# EAGLE design DUCO Miner 10D (EAGLE 9.6.2)
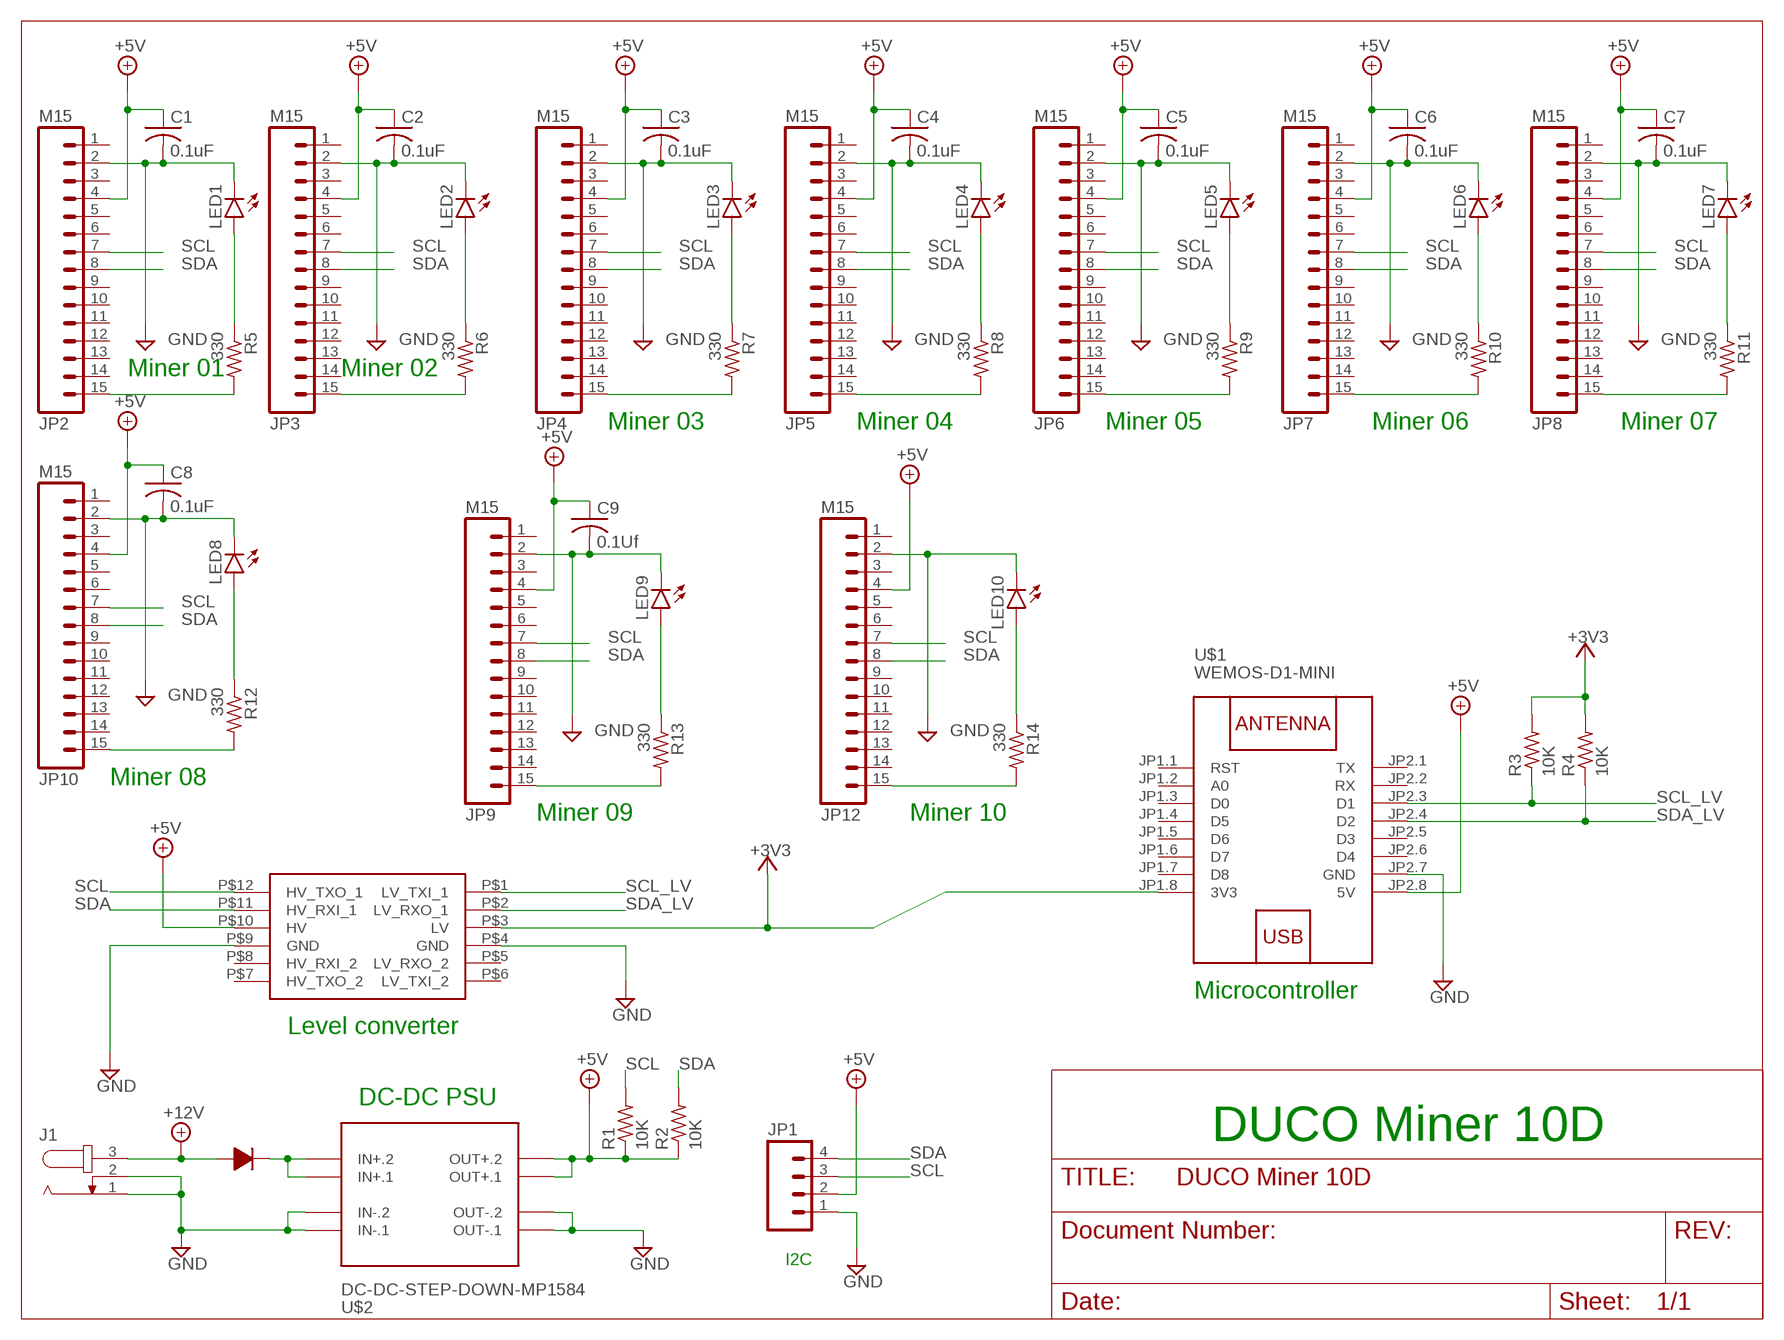
[diagram p0: schematic, sheet 1]

## Parts
C1  0.1uF  C-US025-025X050  [C025-025X050]
C2  0.1uF  C-US025-025X050  [C025-025X050]
C3  0.1uF  C-US025-025X050  [C025-025X050]
C4  0.1uF  C-US025-025X050  [C025-025X050]
C5  0.1uF  C-US025-025X050  [C025-025X050]
C6  0.1uF  C-US025-025X050  [C025-025X050]
C7  0.1uF  C-US025-025X050  [C025-025X050]
C8  0.1uF  C-US025-025X050  [C025-025X050]
C9  0.1Uf  C-US025-025X050  [C025-025X050]
J1  JACK-PLUG1  [SPC4078]
JP1  M04PTH  [1X04]
JP2  M15  [1X15]
JP3  M15  [1X15]
JP4  M15  [1X15]
JP5  M15  [1X15]
JP6  M15  [1X15]
JP7  M15  [1X15]
JP8  M15  [1X15]
JP9  M15  [1X15]
JP10  M15  [1X15]
JP12  M15  [1X15]
LED1  LED3MM  [LED3MM]
LED2  LED3MM  [LED3MM]
LED3  LED3MM  [LED3MM]
LED4  LED3MM  [LED3MM]
LED5  LED3MM  [LED3MM]
LED6  LED3MM  [LED3MM]
LED7  LED3MM  [LED3MM]
LED8  LED3MM  [LED3MM]
LED9  LED3MM  [LED3MM]
LED10  LED3MM  [LED3MM]
R1  10K  R-US_0204/7  [0204/7]
R2  10K  R-US_0204/7  [0204/7]
R3  10K  R-US_0204/7  [0204/7]
R4  10K  R-US_0204/7  [0204/7]
R5  330  R-US_0204/7  [0204/7]
R6  330  R-US_0204/7  [0204/7]
R7  330  R-US_0204/7  [0204/7]
R8  330  R-US_0204/7  [0204/7]
R9  330  R-US_0204/7  [0204/7]
R10  330  R-US_0204/7  [0204/7]
R11  330  R-US_0204/7  [0204/7]
R12  330  R-US_0204/7  [0204/7]
R13  330  R-US_0204/7  [0204/7]
R14  330  R-US_0204/7  [0204/7]
U$1  WEMOS-D1-MINI  [WEMOS-D1-MINI]
U$2  DC-DC-STEP-DOWN-MP1584  [DC-DC-STEP-DOWN-MP1584]
U$3  LOGIC_LEVEL_CONVERTER  [LOGIC_LEVEL_CONVERTER]
U$4  1N4001  [DIODE-12.70]

## Nets
+3V3: R3.2 R4.2 U$1.JP1.8(3V3) U$3.P$3(LV)
+5V: C1.1 C2.1 C3.1 C4.1 C5.1 C6.1 C7.1 C8.1 C9.1 JP1.2 JP2.4 JP3.4 JP4.4 JP5.4 JP6.4 JP7.4 JP8.4 JP9.4 JP10.4 JP12.4 R1.1 R2.1 U$1.JP2.8(5V) U$2.OUT+.1 U$2.OUT+.2 U$3.P$10(HV)
+12V: J1.3 U$4.P$1
GND: C1.2 C2.2 C3.2 C4.2 C5.2 C6.2 C7.2 C8.2 C9.2 J1.1 J1.2 JP1.1 JP2.2 JP3.2 JP4.2 JP5.2 JP6.2 JP7.2 JP8.2 JP9.2 JP10.2 JP12.2 LED1.K(C) LED2.K(C) LED3.K(C) LED4.K(C) LED5.K(C) LED6.K(C) LED7.K(C) LED8.K(C) LED9.K(C) LED10.K(C) U$1.JP2.7(GND) U$2.IN-.1 U$2.IN-.2 U$2.OUT-.1 U$2.OUT-.2 U$3.P$4(GND) U$3.P$9(GND)
N$1: JP2.15 R5.2
N$2: U$2.IN+.1 U$2.IN+.2 U$4.P$2
N$3: LED1.A R5.1
N$4: JP12.15 R14.2
N$5: JP3.15 R6.2
N$6: LED2.A R6.1
N$7: JP9.15 R13.2
N$8: JP4.15 R7.2
N$9: LED3.A R7.1
N$10: JP10.15 R12.2
N$11: JP5.15 R8.2
N$12: LED4.A R8.1
N$13: JP6.15 R9.2
N$14: LED5.A R9.1
N$15: JP7.15 R10.2
N$16: LED6.A R10.1
N$17: LED8.A R12.1
N$18: JP8.15 R11.2
N$19: LED7.A R11.1
N$21: LED9.A R13.1
N$23: LED10.A R14.1
SCL: JP1.3 JP2.7 JP3.7 JP4.7 JP5.7 JP6.7 JP7.7 JP8.7 JP9.7 JP10.7 JP12.7 R1.2 U$3.P$12(HV_TXO_1)
SCL_LV: R3.1 U$1.JP2.3(D1) U$3.P$1(LV_TXI_1)
SDA: JP1.4 JP2.8 JP3.8 JP4.8 JP5.8 JP6.8 JP7.8 JP8.8 JP9.8 JP10.8 JP12.8 R2.2 U$3.P$11(HV_RXI_1)
SDA_LV: R4.1 U$1.JP2.4(D2) U$3.P$2(LV_RXO_1)
Unconnected: JP2.1 JP2.3 JP2.5 JP2.6 JP2.9 JP2.10 JP2.11 JP2.12 JP2.13 JP2.14 JP3.1 JP3.3 JP3.5 JP3.6 JP3.9 JP3.10 JP3.11 JP3.12 JP3.13 JP3.14 JP4.1 JP4.3 JP4.5 JP4.6 JP4.9 JP4.10 JP4.11 JP4.12 JP4.13 JP4.14 JP5.1 JP5.3 JP5.5 JP5.6 JP5.9 JP5.10 JP5.11 JP5.12 JP5.13 JP5.14 JP6.1 JP6.3 JP6.5 JP6.6 JP6.9 JP6.10 JP6.11 JP6.12 JP6.13 JP6.14 JP7.1 JP7.3 JP7.5 JP7.6 JP7.9 JP7.10 JP7.11 JP7.12 JP7.13 JP7.14 JP8.1 JP8.3 JP8.5 JP8.6 JP8.9 JP8.10 JP8.11 JP8.12 JP8.13 JP8.14 JP9.1 JP9.3 JP9.5 JP9.6 JP9.9 JP9.10 JP9.11 JP9.12 JP9.13 JP9.14 JP10.1 JP10.3 JP10.5 JP10.6 JP10.9 JP10.10 JP10.11 JP10.12 JP10.13 JP10.14 JP12.1 JP12.3 JP12.5 JP12.6 JP12.9 JP12.10 JP12.11 JP12.12 JP12.13 JP12.14 U$1.JP1.1(RST) U$1.JP1.2(A0) U$1.JP1.3(D0) U$1.JP1.4(D5) U$1.JP1.5(D6) U$1.JP1.6(D7) U$1.JP1.7(D8) U$1.JP2.1(TX) U$1.JP2.2(RX) U$1.JP2.5(D3) U$1.JP2.6(D4) U$3.P$5(LV_RXO_2) U$3.P$6(LV_TXI_2) U$3.P$7(HV_TXO_2) U$3.P$8(HV_RXI_2)

## Notes on the sheet
- Miner 01 | Miner 02
- Miner 03 | Miner 04 | Miner 05 | Miner 06 | Miner 07
- Miner 08
- Miner 09 | Miner 10
- Microcontroller
- Level converter
- DC-DC PSU
- DUCO Miner 10D
- I2C

## Library data of the parts
C1-C9 = rcl:C-US: CAPACITOR, American symbol; SPICEPREFIX: C
J1 = con-jack:JACK-PLUG: DC POWER JACK Power Jack, DC, Right Angle, Through Hole, Rated 5A at 16VDC, PC Terminals Distributor: Farnell (www.Farnell.de) Drawing: 84N1161.pdf / 84N1162.pdf Manufacturer: SPC Technology (www.spctechnology.com) Type: SPC4077 / SPC 4078; OC_FARNELL: unknown; OC_NEWARK: unknown
JP1 = SparkFun:M04: Header 4 Standard 4-pin 0.1" header. Use with straight break away headers (SKU : PRT-00116), right angle break away headers (PRT-00553), swiss pins (PRT-00743), machine pins (PRT-00117), and female headers (PRT-00115). Molex polarized connector foot print use with SKU : PRT-08231 with associated crimp pins and housings. 1MM SMD Version SKU: PRT-10208
JP2-JP10 JP12 = SparkFun:M15: Header 15 Standard 15-pin 0.1" header. Use with straight break away headers (SKU : PRT-00116), right angle break away headers (PRT-00553), swiss pins (PRT-00743), machine pins (PRT-00117), and female headers (PRT-00115).
LED1-LED10 = led:LED: LED OSRAM: - CHIPLED LG R971, LG N971, LY N971, LG Q971, LY Q971, LO R971, LY R971 LH N974, LH R974 LS Q976, LO Q976, LY Q976 LO Q996 - Hyper CHIPLED LW Q18S LB Q993, LB Q99A, LB R99A - SideLED LS A670, LO A670, LY A670, LG A670, LP A670 LB A673, LV A673, LT A673, LW A673 LH A674 LY A675 LS A676, LA A676, LO A676, LY A676, LW A676 LS A679, LY A679, LG A679 - Hyper Micro SIDELED® LS Y876, LA Y876, LO Y876, LY Y876 LT Y87S - SmartLED LW L88C, LW L88S LB L89C, LB L89S, LG L890 LS L89K, LO L89K, LY L89K LS L896, LA L896, LO L896, LY L896 - TOPLED LS T670, LO T670, LY T670, LG T670, LP T670 LSG T670, LSP T670, LSY T670, LOP T670, LYG T670 LG T671, LOG T671, LSG T671 LB T673, LV T673, LT T673, LW T673 LH T674 LS T676, LA T676, LO T676, LY T676, LB T676, LH T676, LSB T676, LW T676 LB T67C, LV T67C, LT T67C, LS T67K, LO T67K, LY T67K, LW E67C LS E67B, LA E67B, LO E67B, LY E67B, LB E67C, LV E67C, LT E67C LW T67C LS T679, LY T679, LG T679 LS T770, LO T770, LY T770, LG T770, LP T770 LB T773, LV T773, LT T773, LW T773 LH T774 LS E675, LA E675, LY E675, LS T675 LS T776, LA T776, LO T776, LY T776, LB T776 LHGB T686 LT T68C, LB T68C - Hyper Mini TOPLED® LB M676 - Mini TOPLED Santana® LG M470 LS M47K, LO M47K, LY M47K Source: http://www.osram.convergy.de LUXEON: - LUMILED® LXK2-PW12-R00, LXK2-PW12-S00, LXK2-PW14-U00, LXK2-PW14-V00 LXK2-PM12-R00, LXK2-PM12-S00, LXK2-PM14-U00 LXK2-PE12-Q00, LXK2-PE12-R00, LXK2-PE12-S00, LXK2-PE14-T00, LXK2-PE14-U00 LXK2-PB12-K00, LXK2-PB12-L00, LXK2-PB12-M00, LXK2-PB14-N00, LXK2-PB14-P00, LXK2-PB14-Q00 LXK2-PR12-L00, LXK2-PR12-M00, LXK2-PR14-Q00, LXK2-PR14-R00 LXK2-PD12-Q00, LXK2-PD12-R00, LXK2-PD12-S00 LXK2-PH12-R00, LXK2-PH12-S00 LXK2-PL12-P00, LXK2-PL12-Q00, LXK2-PL12-R00 Source: www.luxeon.com KINGBRIGHT: KA-3528ASYC Source: www.kingbright.com
R1-R4 = rcl:R-US_: RESISTOR, American symbol; SPICEPREFIX: R
R5-R14 = rcl:R-US_: RESISTOR, American symbol
U$1 = diy-modules:WEMOS-D1-MINI: WEMOS D1 mini: Mini Wi-Fi Board based on ESP-8266 device More details can be found here: https://www.wemos.cc/product/d1-mini.html Click here to find device on ebay.com <http://www.ebay.com/sch/wemos+d1+mini+nodemcu>
U$2 = diy-modules:DC-DC-STEP-DOWN-MP1584: DC/DC Step-Down Regulator based on MP1584 chip MP1584 datasheet available here: http://www.haoyuelectronics.com/Attachment/MP1584/MP1584.pdf Click here to find device on ebay.com <http://www.ebay.com/sch/mp1584+module>
U$3 = SparkFun-Boards:LOGIC_LEVEL_CONVERTER: Logic Level Converter (3.3v - 5v) https://www.sparkfun.com/products/8745
U$4 = Oles komponentbibliotek:1N4001: 1N4001 diode

## Board
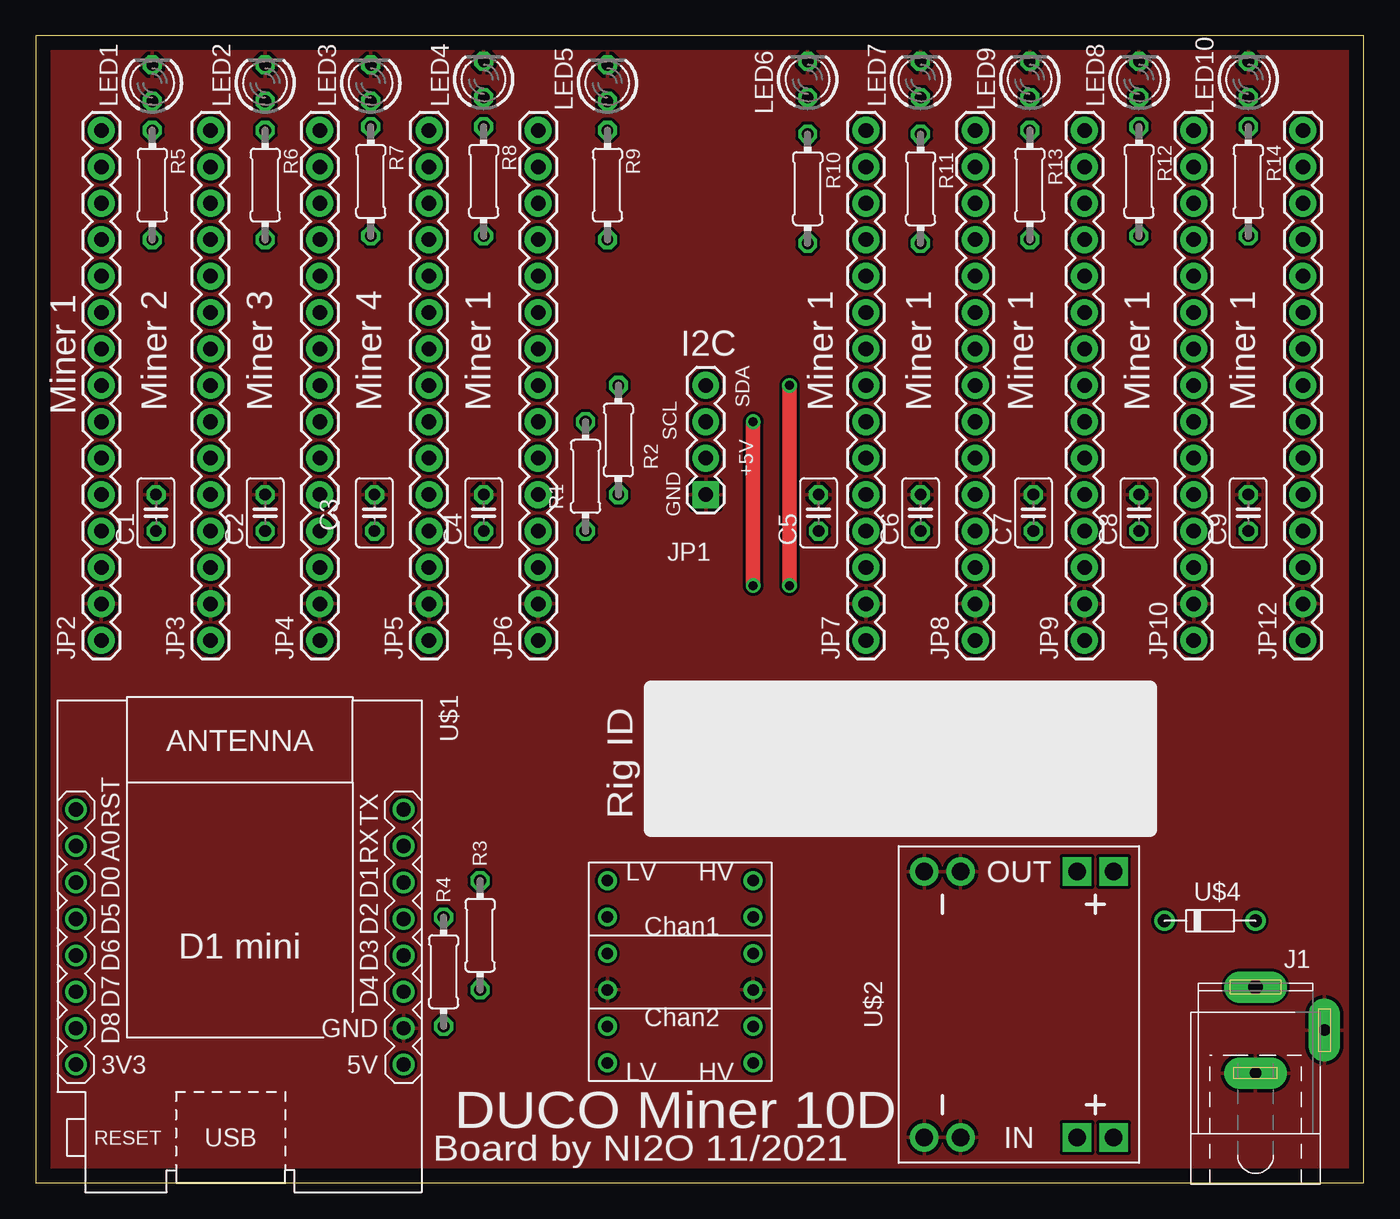
[diagram p1: board, top side]
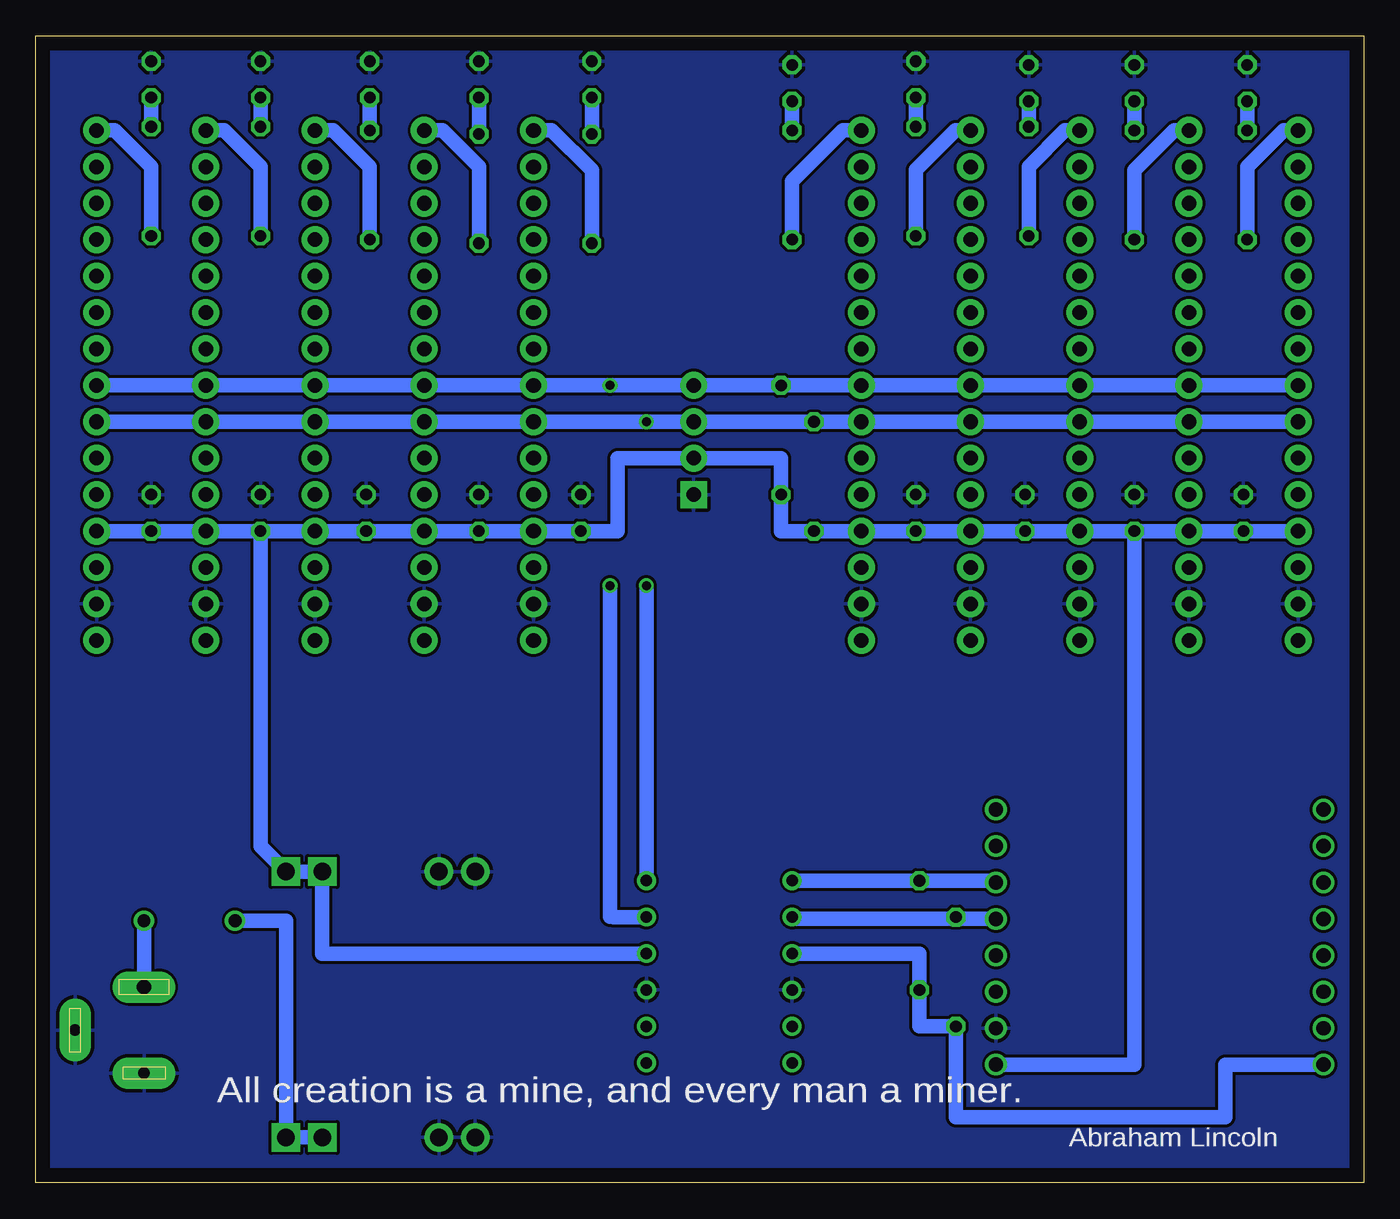
[diagram p2: board, bottom side, seen from below]

Size 92.63 x 80 mm. Coordinates in mm from the lower left corner, seen from the top.
Outline: 0,0 92.63,0 92.63,80 0,80 0,0
Copper layers (1*16): Top 0.035mm / dielectric 1.5mm / Bottom 0.035mm
Design rules "default": minimum track width 10mil, minimum drill 24mil, track to track 8mil, track to pad 8mil, pad to pad 8mil, via to via 8mil, smd to smd 8mil, copper to edge 40mil, drill to drill 8mil, minimum pad ring 10mil, minimum via ring 8mil, stop-mask expansion 4mil, vias tented up to drill 0mil, thermal gap 10mil

### Footprints (pad centres in the part's own frame; a part is rotated, then mirrored left to right if it is on the bottom)
C025-025X050 = drill 0.813 octagon: 1 -1.27,0; 2 1.27,0
SPC4078 = drill 0.8 pad 2.184 long: 1 -3,0; 2 0,-4.8 | drill 1 pad 2.184 long: 3 3,0
1X04 = drill 1.016 pad 1.88 square: 1 0,0 | drill 1.016 pad 1.88: 2 2.54,0; 3 5.08,0; 4 7.62,0
1X15 = drill 1.016 pad 1.88: 1 0,0; 2 2.54,0; 3 5.08,0; 4 7.62,0; 5 10.16,0; 6 12.7,0; 7 15.24,0; 8 17.78,0; 9 20.32,0; 10 22.86,0; 11 25.4,0; 12 27.94,0; 13 30.48,0; 14 33.02,0; 15 35.56,0
LED3MM = drill 0.813 octagon: A -1.27,0; K 1.27,0
0204/7 = drill 0.813 octagon: 1 -3.81,0; 2 3.81,0
WEMOS-D1-MINI = drill 1: JP1.1 -11.43,9.525; JP1.2 -11.43,6.985; JP1.3 -11.43,4.445; JP1.4 -11.43,1.905; JP1.5 -11.43,-0.635; JP1.6 -11.43,-3.175; JP1.7 -11.43,-5.715; JP1.8 -11.43,-8.255; JP2.1 11.43,9.525; JP2.2 11.43,6.985; JP2.3 11.43,4.445; JP2.4 11.43,1.905; JP2.5 11.43,-0.635; JP2.6 11.43,-3.175; JP2.7 11.43,-5.715; JP2.8 11.43,-8.255
DC-DC-STEP-DOWN-MP1584 = drill 1.2 pad 2 square: IN+.1 -9.271,-4.064; IN+.2 -9.271,-6.604; OUT+.1 9.271,-4.064; OUT+.2 9.271,-6.604 | drill 1.2 pad 2: IN-.1 -9.271,6.604; IN-.2 -9.271,4.064; OUT-.1 9.271,6.604; OUT-.2 9.271,4.064
LOGIC_LEVEL_CONVERTER = drill 0.8: P$1 1.27,13.97; P$2 1.27,11.43; P$3 1.27,8.89; P$4 1.27,6.35; P$5 1.27,3.81; P$6 1.27,1.27; P$7 11.43,1.27; P$8 11.43,3.81; P$9 11.43,6.35; P$10 11.43,8.89; P$11 11.43,11.43; P$12 11.43,13.97
DIODE-12.70 = drill 0.9: P$1 -3.81,0; P$2 2.54,0

### Placement (x,y rotation side)
C1  8.38,46.74 90 top
C2  16,46.74 90 top
C3  23.62,46.74 90 top
C4  31.24,46.74 90 top
C5  54.61,46.74 90 top
C6  61.72,46.74 90 top
C7  69.6,46.74 90 top
C8  76.96,46.74 90 top
C9  84.58,46.74 90 top
J1  85.09,10.67 90 top
JP1  46.74,48.01 90 top
JP2  4.57,37.85 90 top
JP3  12.19,37.85 90 top
JP4  19.81,37.85 90 top
JP5  27.43,37.85 90 top
JP6  35.05,37.85 90 top
JP7  57.91,37.85 90 top
JP8  65.53,37.85 90 top
JP9  73.15,37.85 90 top
JP10  80.77,37.85 90 top
JP12  88.39,37.85 90 top
LED1  8.13,76.71 90 top
LED2  16,76.71 90 top
LED3  23.37,76.71 90 top
LED4  31.24,76.96 90 top
LED5  39.88,76.71 90 top
LED6  53.85,76.96 90 top
LED7  61.72,76.96 90 top
LED8  76.96,76.96 90 top
LED9  69.34,76.96 90 top
LED10  84.58,76.96 90 top
R1  38.35,49.28 90 top
R2  40.64,51.82 90 top
R3  30.99,17.27 270 top
R4  28.45,14.73 270 top
R5  8.13,69.6 270 top
R6  16,69.6 270 top
R7  23.37,69.85 270 top
R8  31.24,69.85 270 top
R9  39.88,69.6 270 top
R10  53.85,69.34 270 top
R11  61.72,69.34 270 top
R12  76.96,69.85 270 top
R13  69.34,69.6 270 top
R14  84.58,69.85 270 top
U$1  14.22,16.51 0 top
U$2  68.58,12.45 90 top
U$3  38.61,7.11 0 top
U$4  81.28,18.29 180 top

### Tracks (layer width: path | path; a pad name or v marks a point on that pad's centre or on a via)
+3V3
  Bottom 1.016: U$1.JP1.8 9.65,8.26 9.65,4.57 28.45,4.57 R4.2 30.99,10.92 R3.2 30.99,16 U$3.P$3
+5V
  Bottom 1.016: U$1.JP2.8 16,8.26 C2.1 JP4.4 | U$3.P$10 72.64,16 U$2.OUT+.1 U$2.OUT+.2 76.96,23.5 C8.1 JP10.4 | JP2.4 C1.1 JP3.4 JP4.4 | JP4.4 C3.1 JP5.4 C4.1 JP6.4 R1.1 40.64,45.47 R2.1 40.64,50.55 JP1.2 52.07,50.55 52.07,45.47 C5.1 JP7.4 C6.1 JP8.4 C7.1 69.85,45.47 JP9.4 JP10.4 | JP12.4 C9.1 JP10.4
+12V
  Bottom 1.016: J1.3 U$4.P$1
GND
  pour Top: 92.71,-0.25 92.71,80.01 0,80.01 0,0
  pour Bottom: 0,0 0,80.01 92.46,80.01 92.46,0
N$1
  Bottom 1.016: R5.2 8.13,70.87 5.59,73.41 JP2.15
N$2
  Bottom 1.016: U$4.P$2 75.18,18.29 U$2.IN+.2 U$2.IN+.1
N$3
  Bottom 1.016: LED1.A R5.1
N$4
  Bottom 1.016: R14.2 84.58,70.87 87.12,73.41 JP12.15
N$5
  Bottom 1.016: R6.2 16,70.61 13.21,73.41 JP3.15
N$6
  Bottom 1.016: LED2.A R6.1
N$7
  Bottom 1.016: R13.2 69.34,70.87 71.88,73.41 JP9.15
N$8
  Bottom 1.016: R7.2 23.37,70.87 20.83,73.41 JP4.15
N$9
  Bottom 1.016: LED3.A R7.1
N$10
  Bottom 1.016: R12.2 76.96,70.87 79.5,73.41 JP10.15
N$11
  Bottom 1.016: 31.11,66.17 R8.2 31.24,70.66 28.5,73.41 JP5.15
N$12
  Bottom 1.016: LED4.A R8.1
N$13
  Bottom 1.016: JP6.15 36.32,73.41 39.88,69.85 R9.2
N$14
  Bottom 1.016: LED5.A R9.1
N$15
  Bottom 1.016: R10.2 53.85,70.61 56.64,73.41 JP7.15
N$16
  Bottom 1.016: LED6.A R10.1
N$17
  Bottom 1.016: LED8.A R12.1
N$18
  Bottom 1.016: R11.2 61.72,70.87 64.26,73.41 JP8.15
N$19
  Bottom 1.016: LED7.A R11.1
N$21
  Bottom 1.016: LED9.A R13.1
N$23
  Bottom 1.016: LED10.A R14.1
SCL  (via drill 0.61)
  Top 1.016: v50.04,53.09 v50.04,41.66
  Bottom 1.016: v50.04,41.66 U$3.P$12 | JP2.7 JP3.7 JP4.7 JP5.7 JP6.7 R1.2 JP1.3 v50.04,53.09 JP7.7 JP8.7 JP9.7 JP10.7 JP12.7
SCL_LV
  Bottom 1.016: U$3.P$1 R3.1 25.65,21.08 U$1.JP2.3
SDA  (via drill 0.61)
  Top 1.016: v52.58,55.63 v52.58,41.66
  Bottom 1.016: U$3.P$11 52.32,18.54 52.58,18.57 v52.58,41.66 | JP2.8 JP3.8 JP4.8 JP5.8 JP6.8 R2.2 JP1.4 JP7.8 v52.58,55.63 JP8.8 JP9.8 JP10.8 JP12.8
SDA_LV
  Bottom 1.016: U$1.JP2.4 28.45,18.41 | 28.45,18.41 39.88,18.41 U$3.P$2 | R4.1 28.45,18.41

### Text on the board
tNames: I2C | Miner 1 | Miner 2 | Miner 3 | Miner 4 | Miner 1 | SDA | Miner 1 | Miner 1 | Miner 1 | Miner 1 | Miner 1 | SCL | +5V | GND | Rig ID | DUCO Miner 10D | Board by NI2O 11/2021
bNames: All creation is a mine, and every man a miner. | Abraham Lincoln